# Altium schematic sheet RTU_LMG_Linear_Voltage_Regulator_3V3.SchDoc
size A; Organization: Altium Limited; Address1: L3, 12a Rodborough Rd; Address2: Frenchs Forest; Address3: NSW; Address4: Australia 2086; SheetNumber: 3; SheetTotal: 17
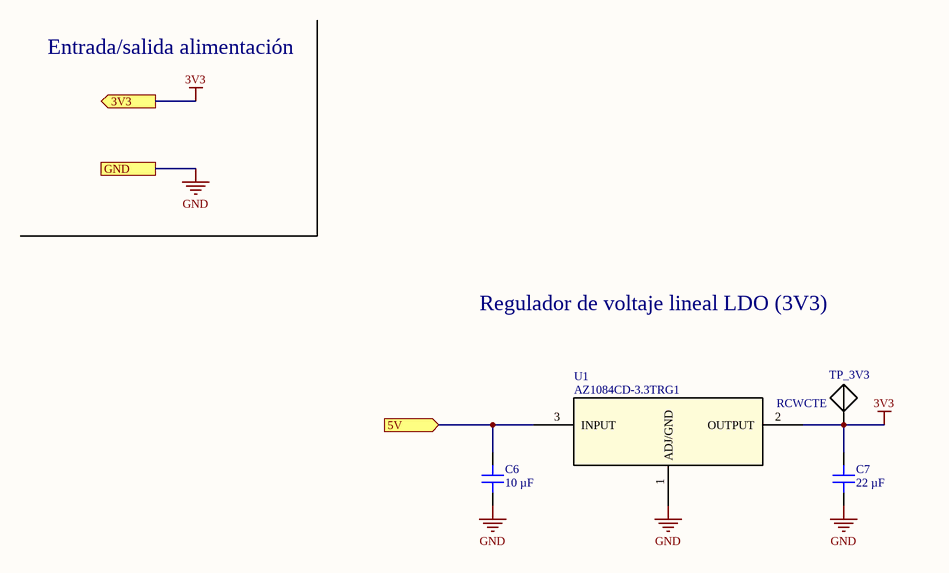
[diagram p0: RTU_LMG_Linear_Voltage_Regulator_3V3.SchDoc]

## Parts
C6  10 µF  [CAP 1210_3225 - 1MM]
C7  22 µF  [CAP 0805_2012]
TP_3V3  RCWCTE  [RCWCTE]
U1  AZ1084CD-3.3TRG1  [TO252-3]

## Ports
3V3 (out), 5V (in), GND

## Nets
3V3: C7.2 TP_3V3.1(TP) U1.2(OUTPUT) ; port 3V3
GND: C6.2 C7.1 U1.1(ADJ/GND) ; port GND
5V: C6.1 U1.3(INPUT) ; port 5V

## Notes on the sheet
- Entrada/salida alimentación
- Regulador de voltaje lineal LDO (3V3)
- Title
- Size:
- Date:
- A
- Number:
- Time:
- Revision:
- Sheet
- of

## Library data of the parts
C6 = C3225X7R1N106K250AC: CAP CER 10UF 75V X7R 1210; manufacturer: TDK Corporation; Tolerance: ±10%; Part Number: C3225X7R1N106K250AC; Value: 10 µF; Applications: General Purpose; Capacitance: 10 µF; componentlink1description: Datasheet; componentlink1url: https://product.tdk.com/info/en/catalog/datasheets/mlcc_commercial_general_en.pdf?ref_disty=digikey; componentlink2description: DigiKey Link; componentlink2url: https://www.digikey.com/en/products/detail/tdk-corporation/C3225X7R1N106K250AC/10413502; Device Package: 1210 (3225 Metric); Features: Low ESL; lastupdated: 10/29/2023 7:38:56 PM; Lifecycle Status: Active; Minimum Order: 1; Mounting Type: Surface Mount, MLCC; Operating Temperature: -55°C ~ 125°C; Package / Case: 1210 (3225 Metric); packaging: TapeAndReel; partid: 45109; Part Status: Active; price: 0.29; series: C; Size / Dimension: 0.126" L x 0.098" W (3.20mm x 2.50mm); Supplier 1: DigiKey; Supplier Part Number 1: 445-C3225X7R1N106K250ACCT-ND; Temperature Coefficient: X7R; Thickness (Max): 0.110" (2.80mm); Voltage - Rated: 75V
C7 = CL21A226MOCLRNC: CAP CER 22UF 16V X5R 0805; manufacturer: Samsung Electro-Mechanics; Tolerance: ±20%; Part Number: CL21A226MOCLRNC; Value: 22 µF; Applications: General Purpose; Capacitance: 22 µF; componentlink1description: Datasheet; componentlink1url: http://www.samsungsem.com/kr/support/product-search/mlcc/CL21A226MOCLRNC.jsp; componentlink2description: DigiKey Link; componentlink2url: https://www.digikey.com/en/products/detail/samsung-electro-mechanics/CL21A226MOCLRNC/5961264; Device Package: 0805 (2012 Metric); Features: Low Profile; lastupdated: 10/30/2023 7:14:19 PM; Lifecycle Status: Active; Minimum Order: 1; Mounting Type: Surface Mount, MLCC; Operating Temperature: -55°C ~ 85°C; Package / Case: 0805 (2012 Metric); packaging: TapeAndReel; partid: 4767; Part Status: Active; price: 0.05; series: CL; Size / Dimension: 0.079" L x 0.049" W (2.00mm x 1.25mm); Supplier 1: DigiKey; Supplier Part Number 1: 1276-6780-1-ND; Temperature Coefficient: X5R; Thickness (Max): 0.037" (0.95mm); Voltage - Rated: 16V
TP_3V3 = RCWCTE: - PC Test Point - - Plating Surface Mount Mounting Type; MF: KOA Speer; Check_prices: https://www.snapeda.com/parts/RCWCTE/KOA+Speer/view-part/?ref=eda; SnapEDA_Link: https://www.snapeda.com/parts/RCWCTE/KOA+Speer/view-part/?ref=snap; Digi-Key_Part_Number: 2019-RCWCTETR-ND; Value: *; Purchase-URL: https://pricing.snapeda.com/search/part/RCWCTE/?ref=eda; Package: None; MP: RCWCTE
U1 = AZ1084CD-3.3TRG1: Fuente regulada LDO - 3V3 - 5A; Mfr_Name: Diodes Inc; Copyright: Copyright (C) 2023 Ultra Librarian. All rights reserved.; Manufacturer_Part_Number: AZ1084CD-3.3TRG1; RefDes: RefDes; Type: DEV